# Altium schematic sheet Power&CAN.SchDoc
size A4
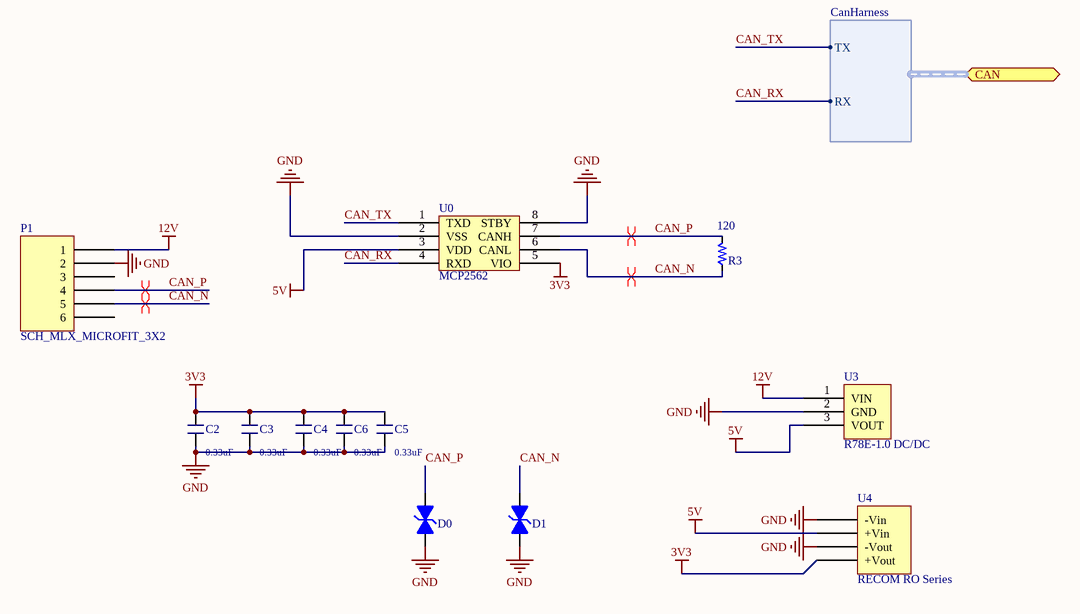
[diagram p0: Power&CAN.SchDoc]

## Parts
C2  Capacitance: 0.33uF  [PCB_GENERIC_SMD_0603]  (hidden comment: SCH_GENERIC_CAPACITOR_0603)
C3  Capacitance: 0.33uF  [PCB_GENERIC_SMD_0603]  (hidden comment: SCH_GENERIC_CAPACITOR_0603)
C4  Capacitance: 0.33uF  [PCB_GENERIC_SMD_0603]  (hidden comment: SCH_GENERIC_CAPACITOR_0603)
C5  Capacitance: 0.33uF  [PCB_GENERIC_SMD_0603]  (hidden comment: SCH_GENERIC_CAPACITOR_0603)
C6  Capacitance: 0.33uF  [PCB_GENERIC_SMD_0603]  (hidden comment: SCH_GENERIC_CAPACITOR_0603)
D0  Bourns TVS Diode 3.3V SOD323  [TVS Diode SOD-323]  (value not drawn)
D1  Bourns TVS Diode 3.3V SOD323  [TVS Diode SOD-323]  (value not drawn)
P1  SCH_MLX_MICROFIT_3X2  [PCB_MLX_MICROFIT_3X2]
R3  Resistance: 120  [PCB_GENERIC_SMD_0603]  (hidden comment: SCH_GENERIC_RESISTOR_0603)
U0  MCP2562  [SOIC127P600X175-8N]
U3  R78E-1.0 DC/DC  [R78-1.0]
U4  RECOM RO Series  [RECOM RO Series 1W DCDC]

## Ports
CAN (harness CanHarness)

## Harnesses
CanHarness: TX, RX

## Nets
3V3: C2.2 C3.2 C4.2 C5.2 C6.2 U0.5(VIO) U4.4(+Vout)
5V: U0.3(VDD) U3.3(VOUT) U4.2(+Vin)
12V: P1.1 U3.1(VIN)
GND: C2.1 C3.1 C4.1 C5.1 C6.1 D0.2 D1.2 P1.2 U0.2(VSS) U0.8(STBY) U3.2(GND) U4.1(-Vin) U4.3(-Vout)
CAN_N: D1.1 P1.5 R3.1 U0.6(CANL)
CAN_P: D0.1 P1.4 R3.2 U0.7(CANH)
CAN_RX: U0.4(RXD) ; port CAN.RX
CAN_TX: U0.1(TXD) ; port CAN.TX

Not connected (* = marked no-connect by the designer): P1 3 6

## Layout directives
differential pair: CAN_N, CAN_P

## Library data of the parts
C2-C6 = SCH_GENERIC_CAPACITOR_0603: Generic SMD capacitor 0603; Tolerance: *%
D0 D1 = Bourns TVS Diode 3.3V SOD323: TVS DIODE 3.3VWM 10.9VC SOD323; Supplier 1: Digi-Key; Supplier Part Number 1: CDSOD323-T03SCCT-ND
R3 = SCH_GENERIC_RESISTOR_0603: Generic SMD resistor 0603
U0 = MCP2562: 1/1 Transceiver Full CAN 8-SOIC
U3 = R78E-1.0
U4 = RECOM RO Series DCDC Converter